# EAGLE design teste1 (EAGLE 9.6.2)
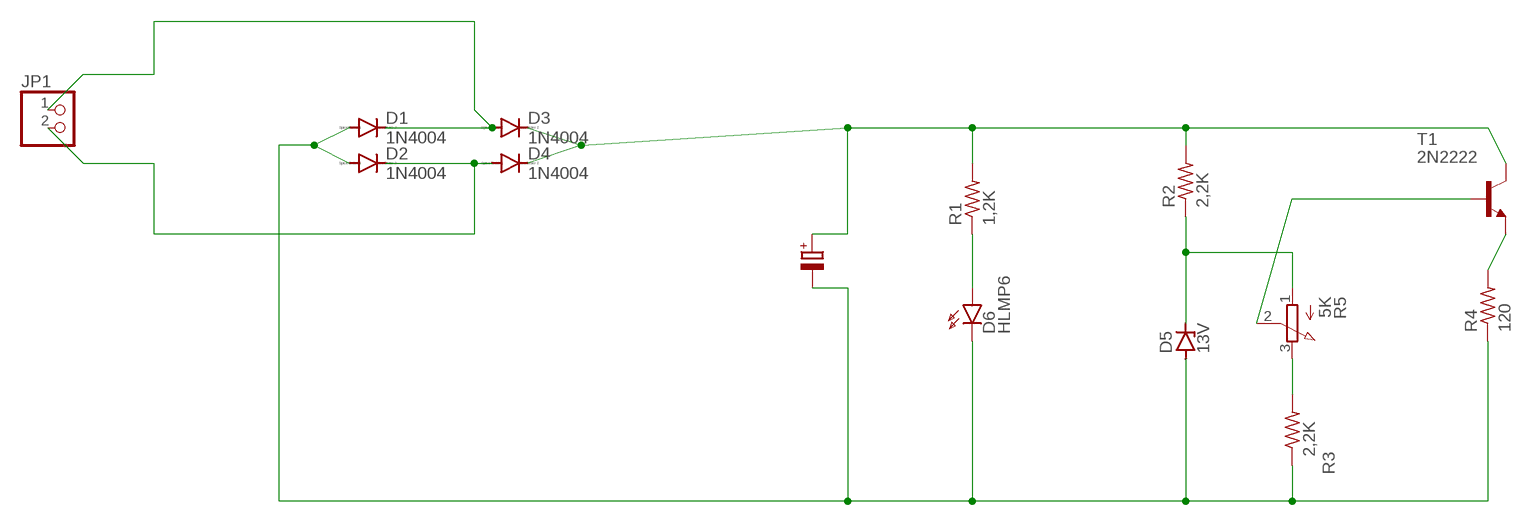
[diagram p0: schematic, sheet 1]

## Parts
D1  1N4004  [DO41-10]
D2  1N4004  [DO41-10]
D3  1N4004  [DO41-10]
D4  1N4004  [DO41-10]
D5  13V  BZD23  [SOD81]
D6  HLMP6  [HLMP6]
JP1  PINHD-1X2  [1X02]
R1  1,2K  R-US_0613/15  [P0613/15]
R2  2,2K  R-US_0613/15  [P0613/15]
R3  2,2K  R-US_0613/15  [P0613/15]
R4  120  R-US_0613/15  [P0613/15]
R5  5K  EVUF2A  [EVUF]
T1  2N2222  [TO18]

## Nets
N$2: D6.A R1.1
N$3: D1.A D2.A D5.A D6.K R3.1 R4.1
N$4: D2.C D4.A JP1.2
N$5: D3.C D4.C R1.2 R2.2 T1.3(C)
N$6: D5.C R2.1 R5.1(A)
N$7: R3.2 R5.3(E)
N$8: R5.2(S) T1.2(B)
N$9: R4.2 T1.1(E)
N$11: D1.C D3.A JP1.1

## Library data of the parts
D1-D4 = diode:1N4004: DIODE general purpose rectifier, 1 A
D5 = diode:BZD23: Z DIODE
D6 = display-hp:HLMP6: LED 2mm horizontal; MF: AGILENT TECHNOLOGIES; MPN: HLMP-6500; OC_FARNELL: 1652490; OC_NEWARK: 40K0088
JP1 = pinhead:PINHD-1X2: PIN HEADER
R1-R4 = rcl:R-US_: RESISTOR, American symbol; SPICEPREFIX: R
R5 = pot:EVU: 9 mm Square Rotary Potentiometers Source: Panasonic
T1 = transistor:2N2222: NPN TRANSISTOR

## Board
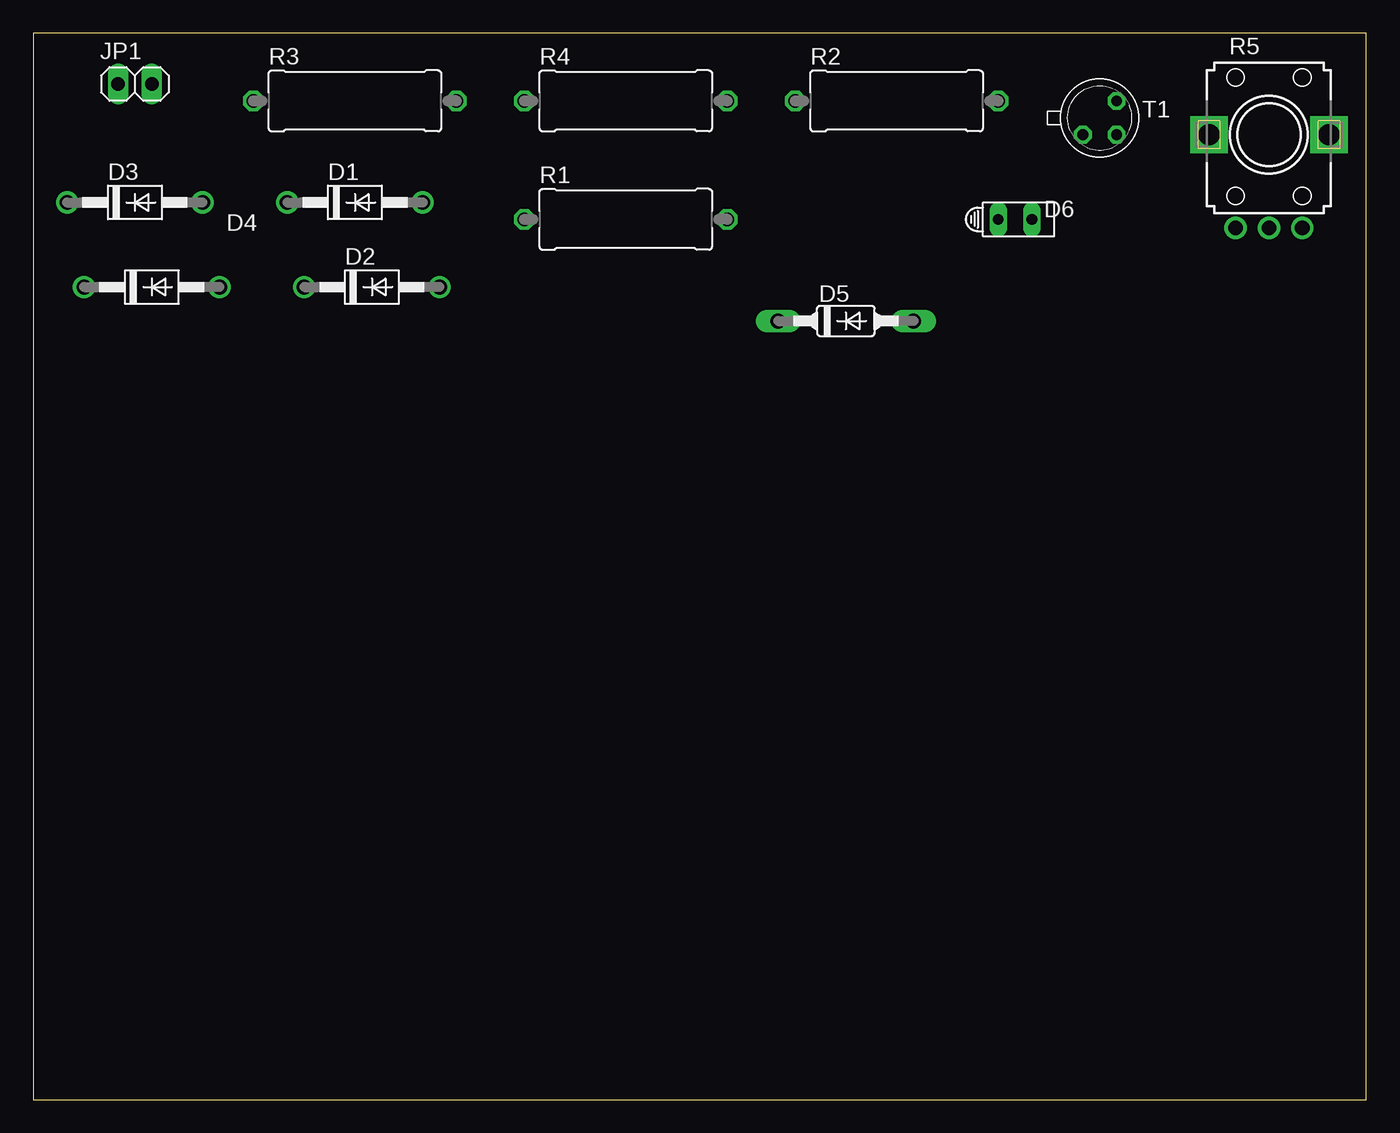
[diagram p1: board, top side]
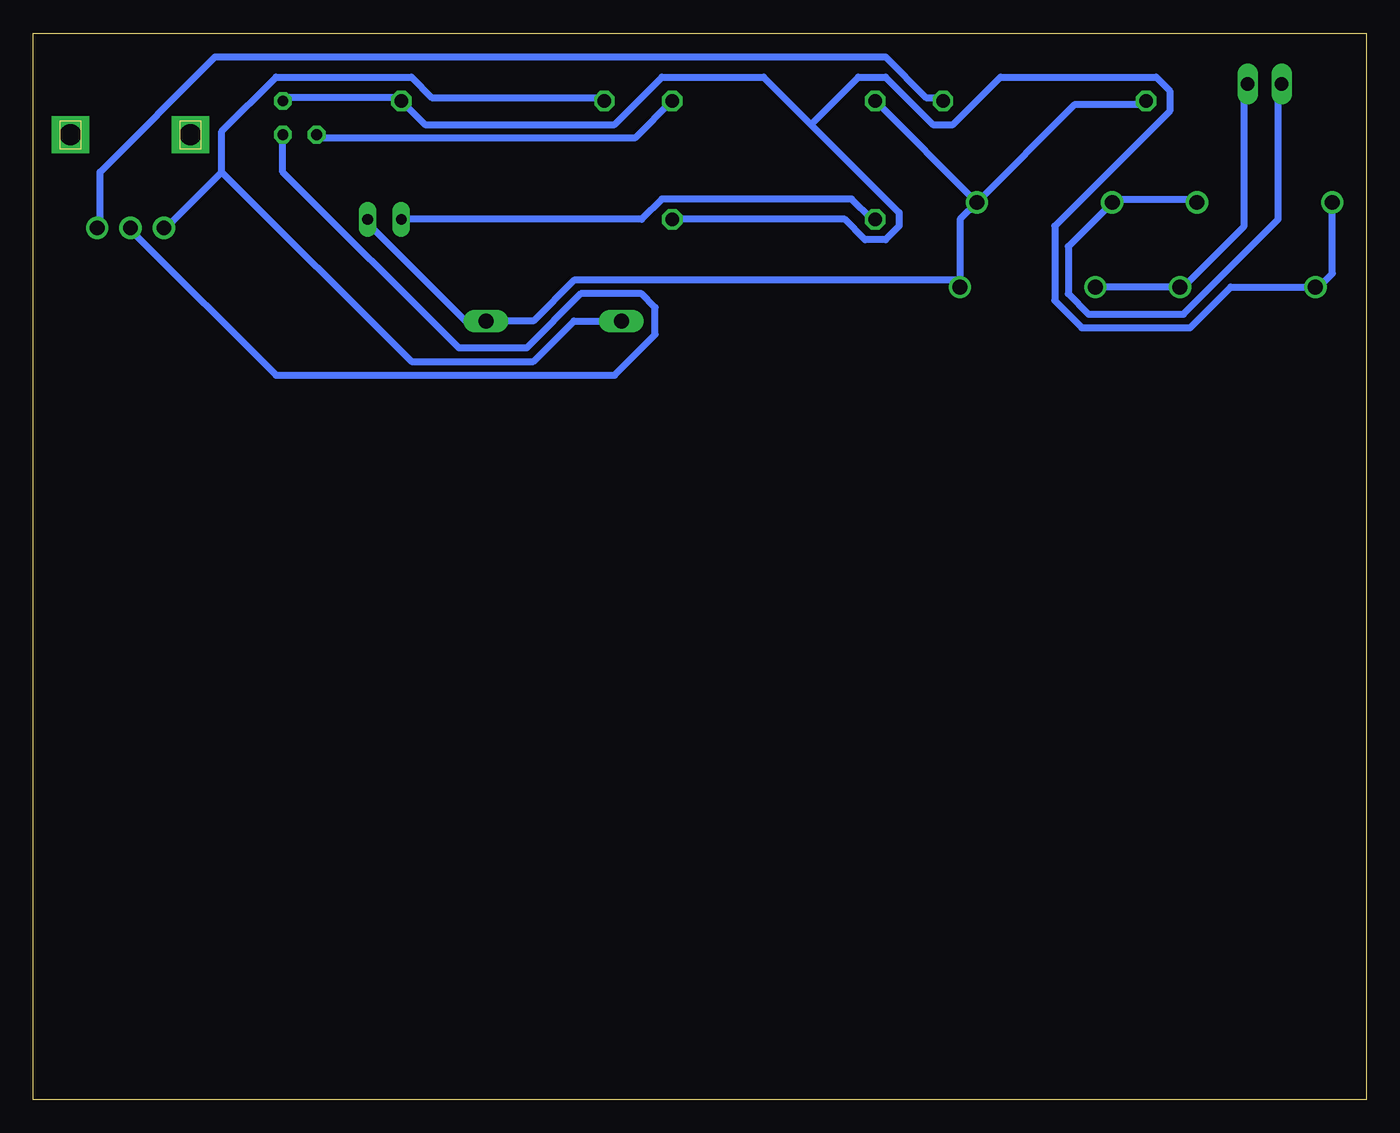
[diagram p2: board, bottom side, seen from below]

Size 100 x 80 mm. Coordinates in mm from the lower left corner, seen from the top.
Outline: 0,0 100,0 100,80 0,80 0,0
Copper layers (1*16): Top 0.035mm / dielectric 1.5mm / Bottom 0.035mm
Design rules "default *": minimum track width 20mil, minimum drill 0.35mm, track to track 20mil, track to pad 20mil, pad to pad 20mil, via to via 20mil, smd to smd 6mil, copper to edge 40mil, drill to drill 6mil, minimum pad ring 10mil, minimum via ring 8mil, stop-mask expansion 4mil, vias tented up to drill 0mil, thermal gap 10mil

### Footprints (pad centres in the part's own frame; a part is rotated, then mirrored left to right if it is on the bottom)
DO41-10 = drill 1.118: A 5.08,0; C -5.08,0
SOD81 = drill 1.118 long: A 5.08,0; C -5.08,0
HLMP6 = drill 0.813 long: A -1.27,0; K 1.27,0
1X02 = drill 1.016 long: 1 -1.27,0; 2 1.27,0
P0613/15 = drill 1.016 octagon: 1 -7.62,0; 2 7.62,0
EVUF = drill 1.1 pad 1.676: 1 -2.5,-7; 2 0,-7; 3 2.5,-7 | drill 1.6 pad 2.8 square: M1 4.5,0; M2 -4.5,0
TO18 = drill 0.813 octagon: 1 -1.27,-1.27; 2 1.27,-1.27; 3 1.27,1.27

### Placement (x,y rotation side)
D1  24.13,67.31 0 top
D2  25.4,60.96 0 top
D3  7.62,67.31 0 top
D4  8.89,60.96 0 top
D5  60.96,58.42 0 top
D6  73.66,66.04 0 top
JP1  7.62,76.2 0 top
R1  44.45,66.04 0 top
R2  64.77,74.93 0 top
R3  24.13,74.93 0 top
R4  44.45,74.93 0 top
R5  92.71,72.39 0 top
T1  80.01,73.66 0 top

### Tracks (layer width: path | path; a pad name or v marks a point on that pad's centre or on a via)
N$2
  Bottom 0.508: D6.A 54.36,66.04 52.83,67.56 38.61,67.56 37.08,66.04 R1.1
N$3
  Bottom 0.508: D6.K 74.68,66.04 74.68,65.53 67.56,58.42 D5.A 62.48,58.42 59.44,61.47 30.48,61.47 | D1.A 21.84,74.68 16.76,74.68 R3.1 | D1.A R4.1 | 30.48,61.47 30.48,66.04 D1.A | 30.48,61.47 D2.A
N$4
  Bottom 0.508: JP1.2 9.14,76.2 9.14,65.53 13.72,60.96 D4.A D2.C
N$5
  Bottom 0.508: D3.C 2.54,61.98 3.56,60.96 D4.C 10.16,60.96 13.21,57.91 21.34,57.91 23.37,59.94 23.37,65.53 14.73,74.17 14.73,75.69 15.75,76.71 27.43,76.71 30.99,73.15 32.51,73.15 36.07,76.71 38.1,76.71 41.66,73.15 | T1.3 81.28,75.18 72.64,75.18 R2.2 70.61,73.15 56.39,73.15 52.83,76.71 45.21,76.71 41.66,73.15 | R1.2 39.12,66.04 37.59,64.52 36.07,64.52 35.05,65.53 35.05,66.55 41.66,73.15
N$6
  Bottom 0.508: 85.85,69.6 85.85,72.64 81.79,76.71 71.63,76.71 70.1,75.18 57.4,75.18 R2.1 | 85.85,69.6 89.92,65.53 R5.1 | D5.C 59.44,58.42 62.48,55.37 71.63,55.37 85.85,69.6
N$7
  Bottom 0.508: R3.2 32,75.18 33.02,75.18 36.07,78.23 86.36,78.23 95,69.6 95,65.53 R5.3
N$8
  Bottom 0.508: T1.2 81.28,69.6 68.07,56.39 62.99,56.39 58.93,60.45 54.36,60.45 53.34,59.44 53.34,57.4 56.39,54.36 81.79,54.36 92.46,65.02 R5.2
N$9
  Bottom 0.508: R4.2 54.86,72.14 78.74,72.14 T1.1
N$11
  Bottom 0.508: JP1.1 6.6,76.2 6.6,66.04 13.72,58.93 20.83,58.93 22.35,60.45 22.35,64.01 D1.C 18.8,67.56 12.7,67.56 D3.A